# EAGLE design placa_sensor3 (EAGLE 6.6.0)
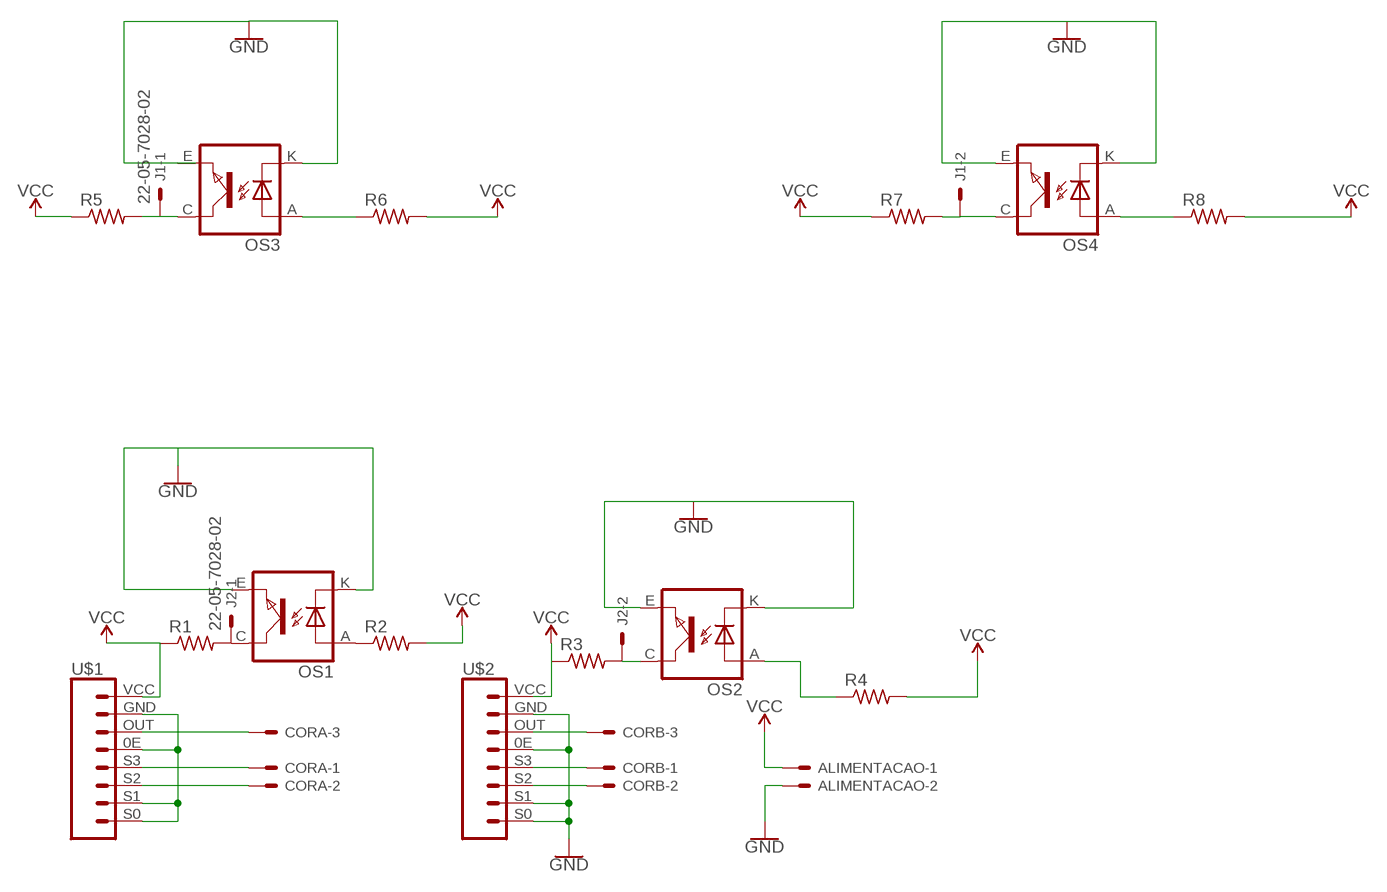
[diagram p0: schematic, sheet 1]

## Parts
ALIMENTACAO  22-05-7028-02  [7395-02]
CORA  22-05-7038-03  [7395-03]
CORB  22-05-7038-03  [7395-03]
J1  22-05-7028-02  [7395-02]
J2  22-05-7028-02  [7395-02]
OS1  TCRT5000  [TCRT5000]
OS2  TCRT5000  [TCRT5000]
OS3  TCRT5000  [TCRT5000]
OS4  TCRT5000  [TCRT5000]
R1  R-US_0204/5  [0204/5]
R2  R-US_0204/5  [0204/5]
R3  R-US_0204/5  [0204/5]
R4  R-US_0204/5  [0204/5]
R5  R-US_0204/5  [0204/5]
R6  R-US_0204/5  [0204/5]
R7  R-US_0204/5  [0204/5]
R8  R-US_0204/5  [0204/5]
U$1  TCS3200_2TCS3200_2  [TCS3200_2]
U$2  TCS3200_2TCS3200_2  [TCS3200_2]

## Nets
GND: ALIMENTACAO.2 OS1.E(EMITTER) OS1.K(CATHODE) OS2.E(EMITTER) OS2.K(CATHODE) OS3.K(CATHODE) OS4.E(EMITTER) OS4.K(CATHODE) U$2.0E U$2.GND U$2.S0 U$2.S1
N$1: CORA.2 U$1.S2
N$2: CORB.1 U$2.S3
N$3: CORB.2 U$2.S2
N$4: CORA.3 U$1.OUT
N$5: CORA.1 U$1.S3
N$6: CORB.3 U$2.OUT
N$7: OS1.A(ANODE) R2.1
N$8: J2.1 OS1.C(COLLECTOR) R1.2
N$9: J2.2 OS2.C(COLLECTOR) R3.2
N$10: U$1.0E U$1.GND U$1.S0 U$1.S1
N$11: OS2.A(ANODE) R4.1
N$12: OS3.A(ANODE) R6.1
N$13: J1.1 OS3.C(COLLECTOR) R5.2
N$15: J1.2 OS4.C(COLLECTOR) R7.2
N$16: OS4.A(ANODE) R8.1
VCC: ALIMENTACAO.1 R1.1 R2.2 R3.1 R4.2 R5.1 R6.2 R7.1 R8.2 U$1.VCC U$2.VCC
Unconnected: OS3.E(EMITTER)

## Library data of the parts
ALIMENTACAO J1 J2 = con-molex:22-?-02: CONNECTOR wire to board 2.54 mm (.1 inch) pitch header; OC_FARNELL: 9731601; OC_NEWARK: unknown
CORA CORB = con-molex:22-?-03: CONNECTOR wire to board 2.54 mm (.1 inch) pitch header; OC_FARNELL: unknown; OC_NEWARK: unknown
OS1-OS4 = Robotica-IFRN-SC:TCRT5000
R1-R8 = rcl:R-US_: RESISTOR, American symbol
U$1 U$2 = Robotica-IFRN-SC:TCS3200_2

## Board
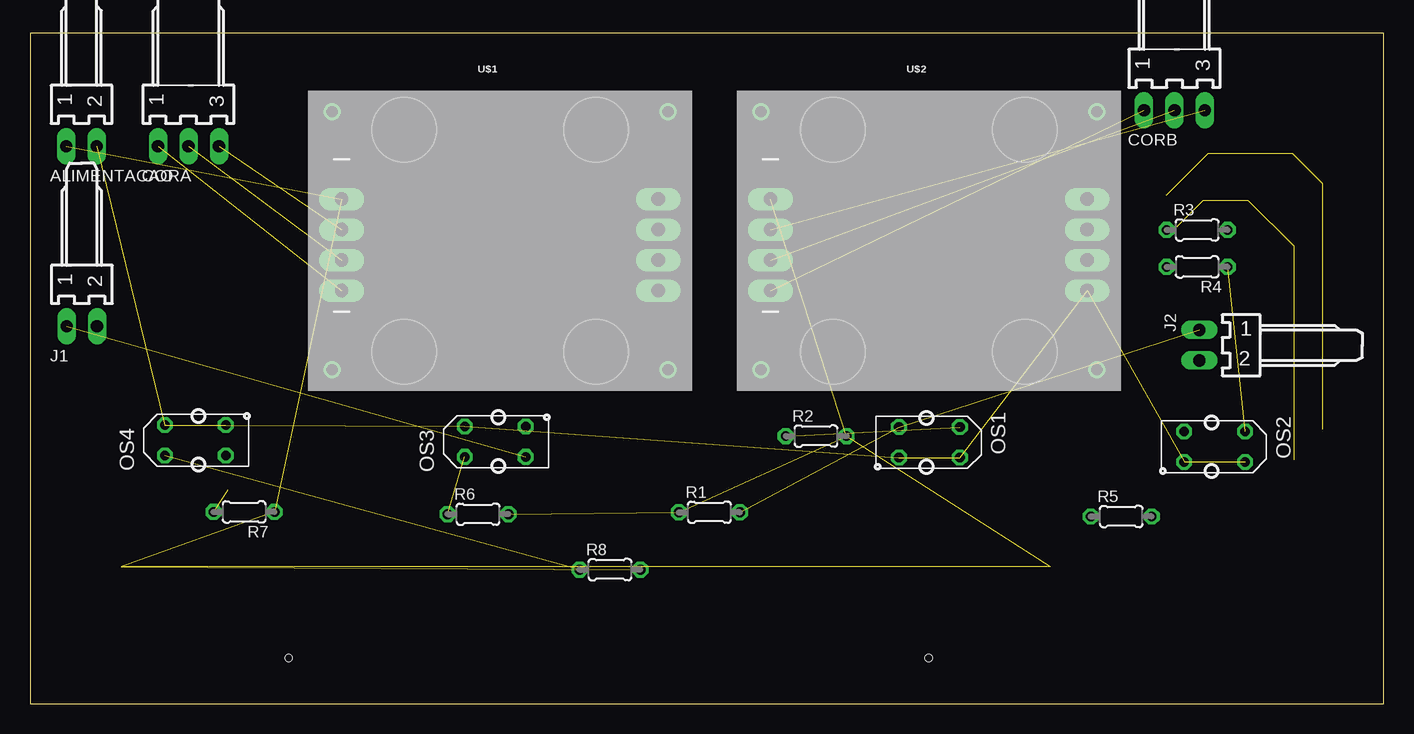
[diagram p1: board, top side]
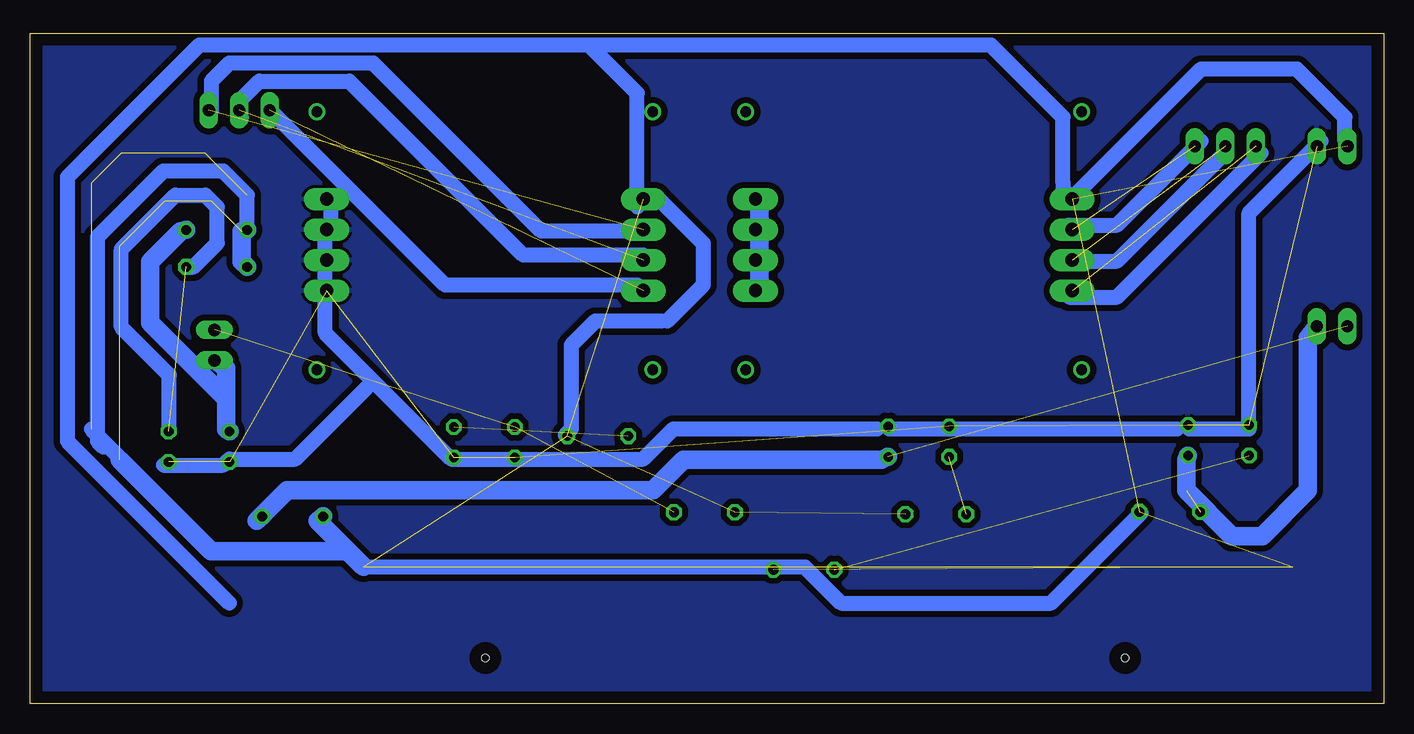
[diagram p2: board, bottom side, seen from below]

Size 112.86 x 55.87 mm. Coordinates in mm from the lower left corner, seen from the top.
Outline: 0,0 112.86,0 112.86,55.87 0,55.87 0,0
Copper layers (1*16): Top 0.035mm / dielectric 1.5mm / Bottom 0.035mm
Design rules "default *": minimum track width 60mil, minimum drill 24mil, track to track 20mil, track to pad 20mil, pad to pad 20mil, via to via 20mil, smd to smd 8mil, copper to edge 40mil, drill to drill 8mil, minimum pad ring 10mil, minimum via ring 8mil, stop-mask expansion 4mil, vias tented up to drill 0mil, thermal gap 10mil
Holes 0.6 mm at 60.93,-31.75 93.95,-10.16 74.9,3.81 21.56,3.81

### Footprints (pad centres in the part's own frame; a part is rotated, then mirrored left to right if it is on the bottom)
7395-02 = drill 1.016 long: 1 1.27,0; 2 -1.27,0
7395-03 = drill 1.016 long: 1 2.54,0; 2 0,0; 3 -2.54,0
TCRT5000 = drill 0.8 octagon: A -2.54,-1.27; C 2.54,-1.27; E 2.54,1.27; K -2.54,1.27
0204/5 = drill 0.813 octagon: 1 -2.54,0; 2 2.54,0
TCS3200_2 = drill 1.118 pad 1.88 long: 0E -4.69,-2.67; GND -4.69,-5.21; OUT 21.71,-2.67; S0 -4.69,2.41; S1 -4.69,-0.13; S2 21.71,-0.13; S3 21.71,2.41; VCC 21.71,-5.21 | drill 0.9: P$1 -5.5,9; P$2 -5.5,-12.5; P$3 22.5,-12.5; P$4 22.5,9

### Placement (x,y rotation side)
ALIMENTACAO  4.3,46.45 180 top
CORA  13.21,46.45 180 top
CORB  95.41,49.45 180 top
J1  4.32,31.45 180 top
J2  97.48,29.87 90 top
OS1  74.98,21.78 180 top
OS2  98.76,21.42 180 top
OS3  38.78,21.84 0 top
OS4  13.78,21.95 0 top
R1  56.64,15.95 0 top
R2  65.53,22.3 0 top
R3  97.3,39.48 0 top
R4  97.3,36.4 180 top
R5  90.97,15.6 0 top
R6  37.35,15.79 0 top
R7  17.85,15.98 180 top
R8  48.35,11.17 0 top
U$1  47.69,36.83 180 top
U$2  83.44,36.83 180 top

### Tracks (layer width: path | path; a pad name or v marks a point on that pad's centre or on a via)
GND  (8 unrouted)
  pour Bottom: 0,55.88 113.19,55.88 113.19,0 0,0
N$1  (1 unrouted)
N$2  (1 unrouted)
N$3  (1 unrouted)
N$4  (1 unrouted)
N$5  (1 unrouted)
N$6  (1 unrouted)
N$7  (1 unrouted)
N$8  (2 unrouted)
N$9
  Bottom 1.524: 96.49,25.4 96.49,27.94 J2.2 | 96.49,25.4 96.49,22.86 OS2.C | 96.49,25.4 102.84,31.75 102.84,36.83 100.3,39.37 R3.2
N$10
  Bottom 1.524: 52.04,36.83 52.04,34.29 U$1.S0 | 52.04,39.37 52.04,41.91 U$1.GND | 52.04,39.37 52.04,36.83 | 52.04,36.83 U$1.S1 | 52.04,39.37 U$1.0E
N$11  (1 unrouted)
N$12  (1 unrouted)
N$13  (1 unrouted)
  Bottom 1.524: OS3.C 41.88,20.32 58.39,20.32 60.93,17.78 91.41,17.78 93.95,15.24 R5.2
N$15  (1 unrouted)
  Bottom 1.524: OS4.C 16.48,20.32 16.48,17.78 12.67,13.97 10.13,13.97 6.32,17.78 6.32,30.48 J1.2
N$16  (1 unrouted)
N$17
  Bottom 1.27: 3.24,46.87 3.24,48.87 7.24,52.87 15.24,52.87 26.24,41.87
N$18
  Bottom 1.27: 26.24,39.87 22.24,39.87 15.24,46.87
N$19
  Bottom 1.27: 26.24,36.87 22.24,36.87 13.24,45.87
N$20
  Bottom 1.27: 26.24,33.87 22.24,33.87 10.24,45.87
N$21
  Bottom 1.27: 5.24,46.87 11.24,40.87 11.24,22.87 16.24,22.87
N$22
  Bottom 1.27: 17.24,22.87 41.24,22.87
N$23
  Bottom 1.27: 42.24,22.87 59.24,22.87 61.74,20.37 77.74,20.37 88.24,30.87 88.24,39.37 87.74,39.87 87.74,41.37 88.24,41.87
N$24
  Bottom 1.27: 101.74,19.87 96.74,19.87 96.24,20.37 90.74,20.37 84.74,26.37
N$25
  Bottom 1.27: 62.24,41.87 60.24,41.87 56.74,38.37 56.74,34.87 59.74,31.87
N$26
  Bottom 1.27: 60.24,31.87 65.74,31.87 67.74,29.87 67.74,22.87 68.24,22.37
N$27
  Bottom 1.27: 62.24,39.37 70.24,39.37 84.24,53.37 96.24,53.37 97.74,51.87 97.74,49.37
N$28
  Bottom 1.27: 26.74,42.37 26.74,42.87 | 66.24,54.87 32.74,54.87 26.74,48.87 26.74,43.37 26.74,42.87 | 66.24,54.87 98.74,54.87 109.74,43.87 109.74,21.87 96.24,8.37 | 62.24,41.37 62.24,50.87 66.24,54.87 | 26.74,42.87 25.74,41.87
N$29
  Bottom 1.27: 95.24,48.87 95.24,50.37 93.74,51.87 86.24,51.87 71.74,37.37 61.74,37.37
N$30
  Bottom 1.27: 62.24,34.87 78.24,34.87 92.74,49.37
N$31  (4 unrouted)
  Bottom 1.27: 94.74,39.37 94.74,42.37 96.74,44.37 101.74,44.37 107.24,38.87 107.24,21.87 106.74,21.37 | 107.74,22.87 104.74,19.87
N$32
  Bottom 1.27: 99.74,36.37 99.24,36.37 97.24,38.37 97.24,41.37 98.24,42.37 100.74,42.37 105.24,37.87 105.24,31.37 101.24,27.37 101.24,22.87
N$33
  Bottom 1.27: 86.74,12.87 85.24,11.37 48.24,11.37 45.24,8.37 27.74,8.37 20.24,15.87
VCC  (13 unrouted)
  Bottom 1.524: R4.2 95.22,36.83 95.22,39.37 R3.1 | 86.33,12.7 88.87,15.24 R5.1 | 86.33,12.7 85.06,11.43 | 105.38,20.32 97.76,12.7 86.33,12.7